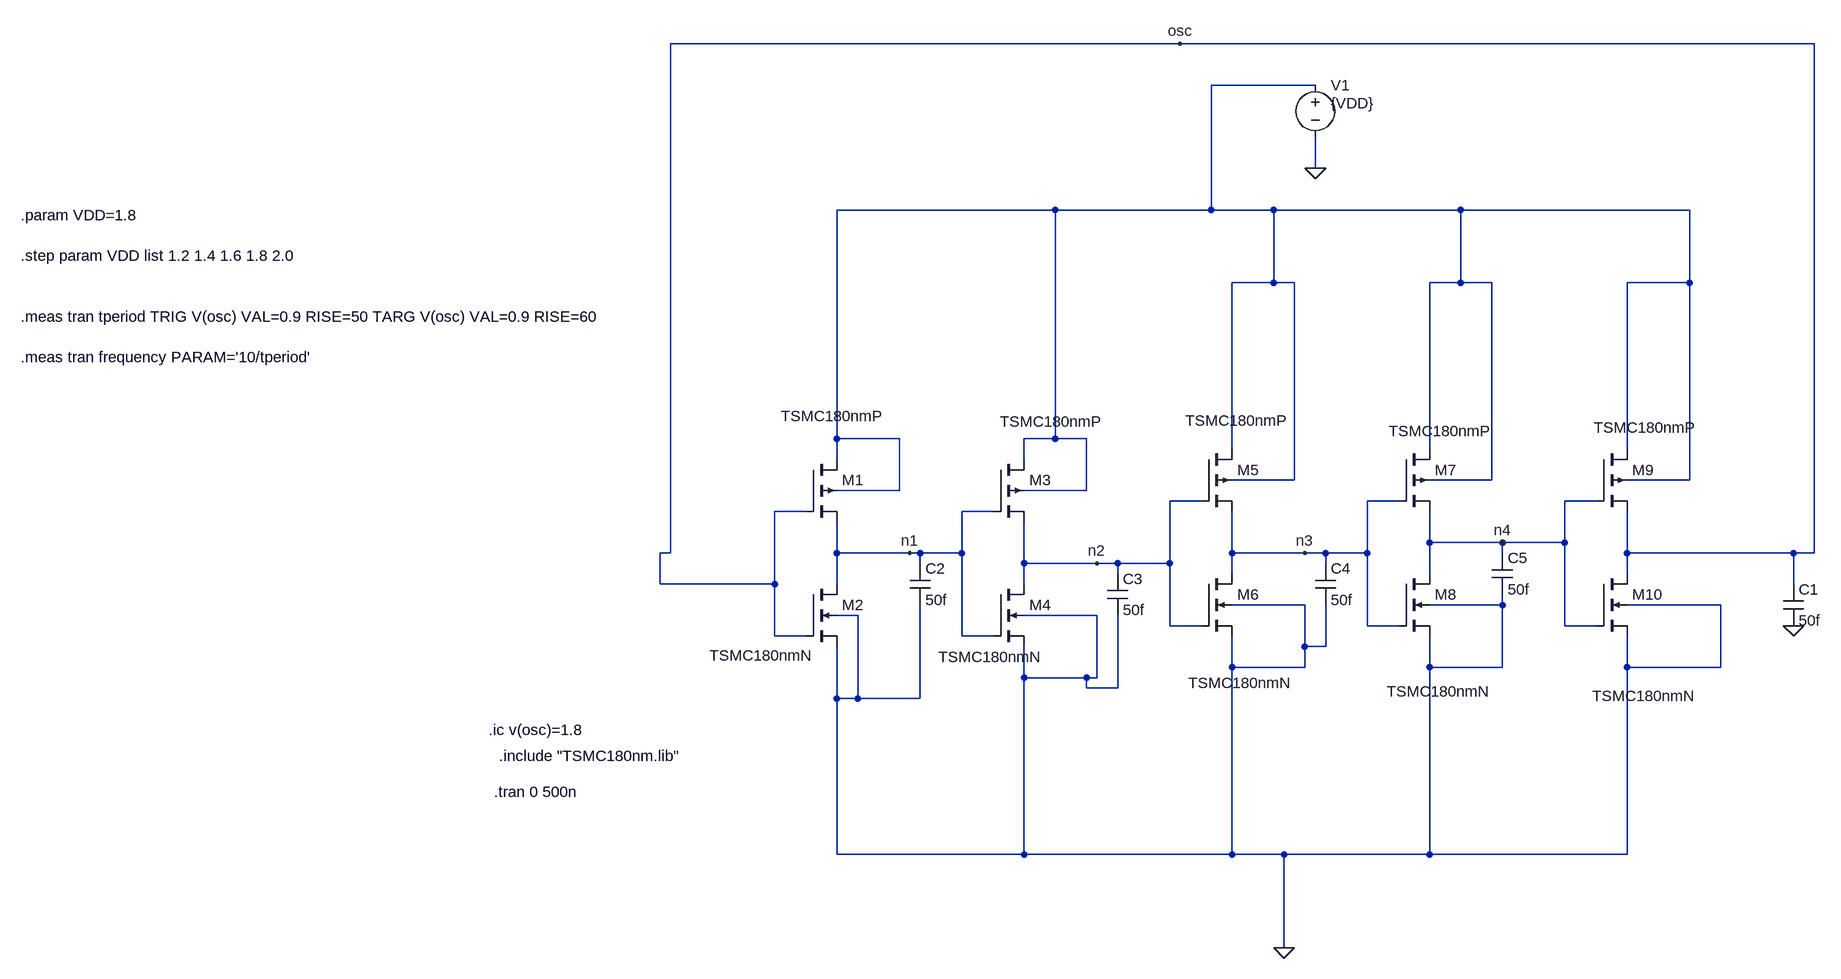
[diagram p0: schematic For Diff Parameters Checking.asc]
For Diff Parameters Checking.asc, the LTspice schematic file:
Version 4.1
SHEET 1 1440 1056
WIRE 432 -400 -352 -400
WIRE 1408 -400 432 -400
WIRE 640 -336 480 -336
WIRE 640 -208 640 -256
WIRE 240 -144 -96 -144
WIRE 480 -144 480 -336
WIRE 480 -144 240 -144
WIRE 576 -144 480 -144
WIRE 864 -144 576 -144
WIRE 1216 -144 864 -144
WIRE 576 -32 576 -144
WIRE 576 -32 512 -32
WIRE 608 -32 576 -32
WIRE 864 -32 864 -144
WIRE 864 -32 816 -32
WIRE 912 -32 864 -32
WIRE 1216 -32 1216 -144
WIRE 1216 -32 1120 -32
WIRE -96 208 -96 -144
WIRE 0 208 -96 208
WIRE 240 208 240 -144
WIRE 240 208 192 208
WIRE 288 208 240 208
WIRE 512 224 512 -32
WIRE 816 224 816 -32
WIRE 1120 224 1120 -32
WIRE -96 240 -96 208
WIRE 192 240 192 208
WIRE 608 272 608 -32
WIRE 608 272 512 272
WIRE 912 272 912 -32
WIRE 912 272 816 272
WIRE 1216 272 1216 -32
WIRE 1216 272 1120 272
WIRE 0 288 0 208
WIRE 0 288 -96 288
WIRE 288 288 288 208
WIRE 288 288 192 288
WIRE 464 304 416 304
WIRE 768 304 720 304
WIRE 1072 304 1024 304
WIRE -144 320 -192 320
WIRE 144 320 96 320
WIRE 816 368 816 320
WIRE 928 368 816 368
WIRE 1024 368 1024 304
WIRE 1024 368 928 368
WIRE -352 384 -352 -400
WIRE -352 384 -368 384
WIRE -96 384 -96 336
WIRE 16 384 -96 384
WIRE 32 384 16 384
WIRE 96 384 96 320
WIRE 96 384 32 384
WIRE 512 384 512 320
WIRE 624 384 512 384
WIRE 656 384 624 384
WIRE 720 384 720 304
WIRE 720 384 656 384
WIRE 928 384 928 368
WIRE 1120 384 1120 320
WIRE 1376 384 1120 384
WIRE 1408 384 1408 -400
WIRE 1408 384 1376 384
WIRE 32 400 32 384
WIRE 192 400 192 336
WIRE 304 400 192 400
WIRE 336 400 304 400
WIRE 416 400 416 304
WIRE 416 400 336 400
WIRE 656 400 656 384
WIRE 336 416 336 400
WIRE 512 416 512 384
WIRE 816 416 816 368
WIRE 1120 416 1120 384
WIRE -368 432 -368 384
WIRE -192 432 -192 320
WIRE -192 432 -368 432
WIRE -96 432 -96 384
WIRE 192 432 192 400
WIRE 1376 432 1376 384
WIRE 624 464 512 464
WIRE 928 464 928 448
WIRE 928 464 816 464
WIRE 1264 464 1120 464
WIRE -64 480 -96 480
WIRE 304 480 192 480
WIRE 416 496 416 400
WIRE 464 496 416 496
WIRE 720 496 720 384
WIRE 768 496 720 496
WIRE 1024 496 1024 368
WIRE 1072 496 1024 496
WIRE -192 512 -192 432
WIRE -144 512 -192 512
WIRE 96 512 96 384
WIRE 144 512 96 512
WIRE 624 528 624 464
WIRE 656 528 656 464
WIRE 656 528 624 528
WIRE 512 560 512 512
WIRE 624 560 624 528
WIRE 624 560 512 560
WIRE 816 560 816 512
WIRE 928 560 928 464
WIRE 928 560 816 560
WIRE 1120 560 1120 512
WIRE 1264 560 1264 464
WIRE 1264 560 1120 560
WIRE 192 576 192 528
WIRE 288 576 192 576
WIRE 304 576 304 480
WIRE 304 576 288 576
WIRE 288 592 288 576
WIRE 336 592 336 480
WIRE 336 592 288 592
WIRE -96 608 -96 528
WIRE -64 608 -64 480
WIRE -64 608 -96 608
WIRE 32 608 32 464
WIRE 32 608 -64 608
WIRE -96 848 -96 608
WIRE 192 848 192 576
WIRE 192 848 -96 848
WIRE 512 848 512 560
WIRE 512 848 192 848
WIRE 592 848 512 848
WIRE 816 848 816 560
WIRE 816 848 592 848
WIRE 1120 848 1120 560
WIRE 1120 848 816 848
WIRE 592 992 592 848
FLAG 592 992 0
FLAG 640 -208 0
FLAG 432 -400 osc
FLAG 16 384 n1
FLAG 304 400 n2
FLAG 624 384 n3
FLAG 928 368 n4
FLAG 1376 496 0
SYMBOL pmos4 -144 240 R0
WINDOW 3 -38 -67 Left 2
SYMATTR Value TSMC180nmP
SYMATTR InstName M1
SYMATTR Value2 l=180n w=2u
SYMBOL nmos4 -144 432 R0
WINDOW 3 -148 110 Left 2
SYMATTR Value TSMC180nmN
SYMATTR InstName M2
SYMATTR Value2 l=180n w=1u
SYMBOL pmos4 144 240 R0
WINDOW 3 11 -58 Left 2
SYMATTR Value TSMC180nmP
SYMATTR InstName M3
SYMATTR Value2 l=180n w=2u
SYMBOL nmos4 144 432 R0
WINDOW 3 -84 112 Left 2
SYMATTR Value TSMC180nmN
SYMATTR InstName M4
SYMATTR Value2 l=180n w=1u
SYMBOL pmos4 464 224 R0
WINDOW 3 -24 -44 Left 2
SYMATTR Value TSMC180nmP
SYMATTR InstName M5
SYMATTR Value2 l=180n w=2u
SYMBOL nmos4 464 416 R0
WINDOW 3 -19 168 Left 2
SYMATTR Value TSMC180nmN
SYMATTR InstName M6
SYMATTR Value2 l=180n w=1u
SYMBOL pmos4 768 224 R0
WINDOW 3 -15 -28 Left 2
SYMATTR Value TSMC180nmP
SYMATTR InstName M7
SYMATTR Value2 l=180n w=2u
SYMBOL nmos4 768 416 R0
WINDOW 3 -18 181 Left 2
SYMATTR Value TSMC180nmN
SYMATTR InstName M8
SYMATTR Value2 l=180n w=1u
SYMBOL pmos4 1072 224 R0
WINDOW 3 -3 -33 Left 2
SYMATTR Value TSMC180nmP
SYMATTR InstName M9
SYMATTR Value2 l=180n w=2u
SYMBOL nmos4 1072 416 R0
WINDOW 3 -6 188 Left 2
SYMATTR Value TSMC180nmN
SYMATTR InstName M10
SYMATTR Value2 l=180n w=1u
SYMBOL voltage 640 -352 R0
WINDOW 3 24 44 Left 2
WINDOW 123 0 0 Left 0
WINDOW 39 0 0 Left 0
SYMATTR Value {VDD}
SYMATTR InstName V1
SYMBOL cap 1360 432 R0
SYMATTR InstName C1
SYMATTR Value 50f
SYMBOL cap 16 400 R0
SYMATTR InstName C2
SYMATTR Value 50f
SYMBOL cap 320 416 R0
SYMATTR InstName C3
SYMATTR Value 50f
SYMBOL cap 640 400 R0
SYMATTR InstName C4
SYMATTR Value 50f
SYMBOL cap 912 384 R0
SYMATTR InstName C5
SYMATTR Value 50f
TEXT -616 696 Left 2 !.include "TSMC180nm.lib"
TEXT -624 752 Left 2 !.tran 0 500n
TEXT -632 656 Left 2 !.ic v(osc)=1.8
TEXT -1352 -136 Left 2 !.param VDD=1.8\n \n.step param VDD list 1.2 1.4 1.6 1.8 2.0\n \n\n.meas tran tperiod TRIG V(osc) VAL=0.9 RISE=50 TARG V(osc) VAL=0.9 RISE=60\n \n.meas tran frequency PARAM='10/tperiod'

The netlist it stands for:
* For Diff Parameters Checking.asc
M1 N001 osc n1 N001 TSMC180nmP l=180n w=2u
M2 n1 osc 0 0 TSMC180nmN l=180n w=1u
M3 N001 n1 n2 N001 TSMC180nmP l=180n w=2u
M4 n2 n1 0 0 TSMC180nmN l=180n w=1u
M5 N001 n2 n3 N001 TSMC180nmP l=180n w=2u
M6 n3 n2 0 0 TSMC180nmN l=180n w=1u
M7 N001 n3 n4 N001 TSMC180nmP l=180n w=2u
M8 n4 n3 0 0 TSMC180nmN l=180n w=1u
M9 N001 n4 osc N001 TSMC180nmP l=180n w=2u
M10 osc n4 0 0 TSMC180nmN l=180n w=1u
V1 N001 0 {VDD}
C1 osc 0 50f
C2 n1 0 50f
C3 n2 0 50f
C4 n3 0 50f
C5 n4 0 50f
.model NMOS NMOS
.model PMOS PMOS
.lib standard.mos
.include "TSMC180nm.lib"
.tran 0 500n
.ic v(osc)=1.8
.param VDD=1.8
.step param VDD list 1.2 1.4 1.6 1.8 2.0
.meas tran tperiod TRIG V(osc) VAL=0.9 RISE=50 TARG V(osc) VAL=0.9 RISE=60
.meas tran frequency PARAM='10/tperiod'
.backanno
.end